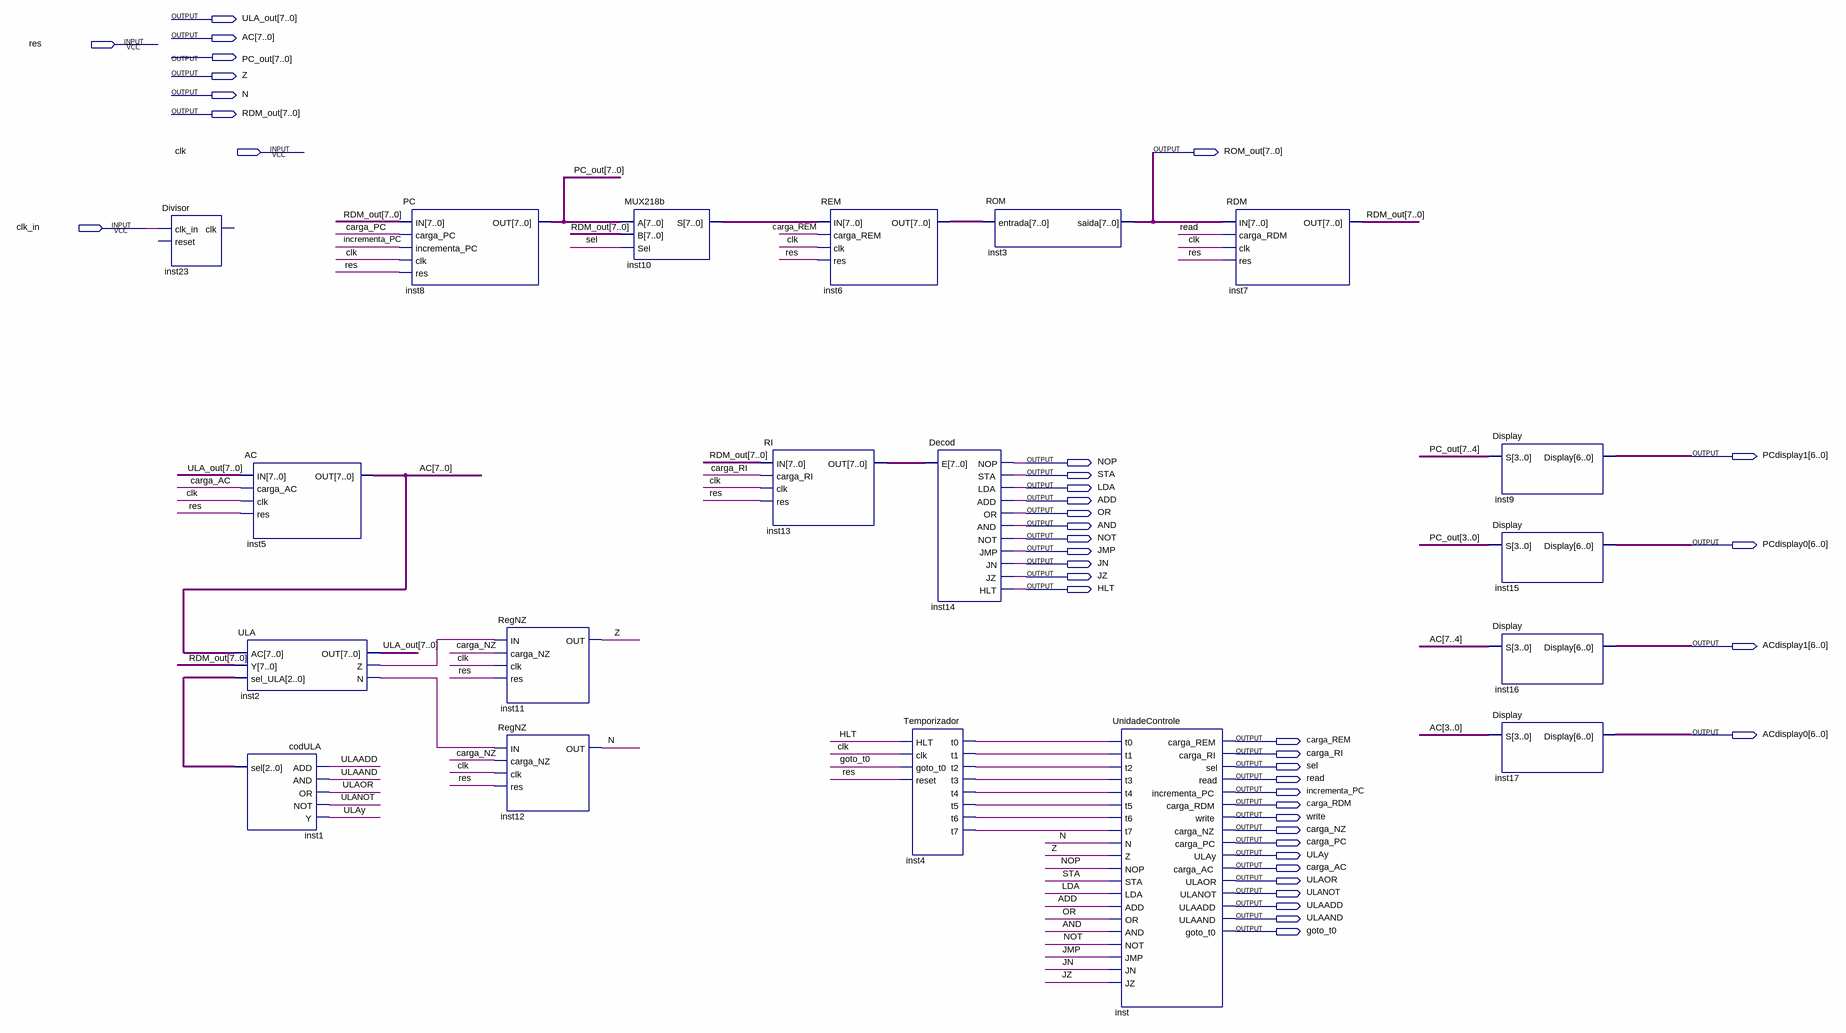
[diagram p0: schematic sheet]
// Quartus schematic Projeto.bdf as structural Verilog: 19 symbols, 41 pins
module Projeto (
  input  res,
  input  clk,
  input  clk_in,
  output [7:0] ULA_out,
  output [7:0] AC,
  output [7:0] PC_out,
  output Z,
  output N,
  output [7:0] RDM_out,
  output [7:0] ROM_out,
  output [6:0] PCdisplay1,
  output NOP,
  output STA,
  output LDA,
  output ADD,
  output OR,
  output AND,
  output NOT,
  output [6:0] PCdisplay0,
  output JMP,
  output JN,
  output JZ,
  output HLT,
  output [6:0] ACdisplay1,
  output [6:0] ACdisplay0,
  output carga_REM,
  output carga_RI,
  output sel,
  output read,
  output incrementa_PC,
  output carga_RDM,
  output write,
  output carga_NZ,
  output carga_PC,
  output ULAy,
  output carga_AC,
  output ULAOR,
  output ULANOT,
  output ULAADD,
  output ULAAND,
  output goto_t0
);

  wire inst2_n, inst2_z, inst4_t0, inst4_t1, inst4_t2, inst4_t3, inst4_t4, inst4_t5, inst4_t6, inst4_t7;
  wire [2:0] inst1_sel;
  wire [7:0] inst6_out, inst10_s, inst13_out;

  Divisor inst23 (.clk_in(clk_in));  // open: reset, clk
  AC inst5 (.IN(ULA_out), .carga_AC(carga_AC), .clk(clk), .res(res), .OUT(AC));
  ULA inst2 (.AC(AC), .Y(RDM_out), .sel_ULA(inst1_sel), .OUT(ULA_out), .Z(inst2_z), .N(inst2_n));
  codULA inst1 (.ADD(ULAADD), .AND(ULAAND), .OR(ULAOR), .NOT(ULANOT), .Y(ULAy), .sel(inst1_sel));
  PC inst8 (.IN(RDM_out), .carga_PC(carga_PC), .incrementa_PC(incrementa_PC), .clk(clk), .res(res), .OUT(PC_out));
  RegNZ inst11 (.IN(inst2_z), .carga_NZ(carga_NZ), .clk(clk), .res(res), .OUT(Z));
  RegNZ inst12 (.IN(inst2_n), .carga_NZ(carga_NZ), .clk(clk), .res(res), .OUT(N));
  MUX218b inst10 (.A(PC_out), .B(RDM_out), .Sel(sel), .S(inst10_s));
  RI inst13 (.IN(RDM_out), .carga_RI(carga_RI), .clk(clk), .res(res), .OUT(inst13_out));
  REM inst6 (.IN(inst10_s), .carga_REM(carga_REM), .clk(clk), .res(res), .OUT(inst6_out));
  Decod inst14 (
    .E(inst13_out), .NOP(NOP), .STA(STA), .LDA(LDA), .ADD(ADD), .OR(OR), .AND(AND), .NOT(NOT), .JMP(JMP),
    .JN(JN), .JZ(JZ), .HLT(HLT));
  Temporizador inst4 (
    .HLT(HLT), .clk(clk), .goto_t0(goto_t0), .reset(res), .t0(inst4_t0), .t1(inst4_t1), .t2(inst4_t2),
    .t3(inst4_t3), .t4(inst4_t4), .t5(inst4_t5), .t6(inst4_t6), .t7(inst4_t7));
  ROM inst3 (.entrada(inst6_out), .saida(ROM_out));
  UnidadeControle inst (
    .t0(inst4_t0), .t1(inst4_t1), .t2(inst4_t2), .t3(inst4_t3), .t4(inst4_t4), .t5(inst4_t5), .t6(inst4_t6),
    .t7(inst4_t7), .N(N), .Z(Z), .NOP(NOP), .STA(STA), .LDA(LDA), .ADD(ADD), .OR(OR), .AND(AND), .NOT(NOT),
    .JMP(JMP), .JN(JN), .JZ(JZ), .carga_REM(carga_REM), .carga_RI(carga_RI), .sel(sel), .read(read),
    .incrementa_PC(incrementa_PC), .carga_RDM(carga_RDM), .write(write), .carga_NZ(carga_NZ),
    .carga_PC(carga_PC), .ULAy(ULAy), .carga_AC(carga_AC), .ULAOR(ULAOR), .ULANOT(ULANOT), .ULAADD(ULAADD),
    .ULAAND(ULAAND), .goto_t0(goto_t0));
  RDM inst7 (.IN(ROM_out), .carga_RDM(read), .clk(clk), .res(res), .OUT(RDM_out));
  Display inst9 (.S(PC_out[7:4]), .Display(PCdisplay1));
  Display inst15 (.S(PC_out[3:0]), .Display(PCdisplay0));
  Display inst16 (.S(AC[7:4]), .Display(ACdisplay1));
  Display inst17 (.S(AC[3:0]), .Display(ACdisplay0));
endmodule
